# EAGLE design tmod-pi (EAGLE 7.7.0)
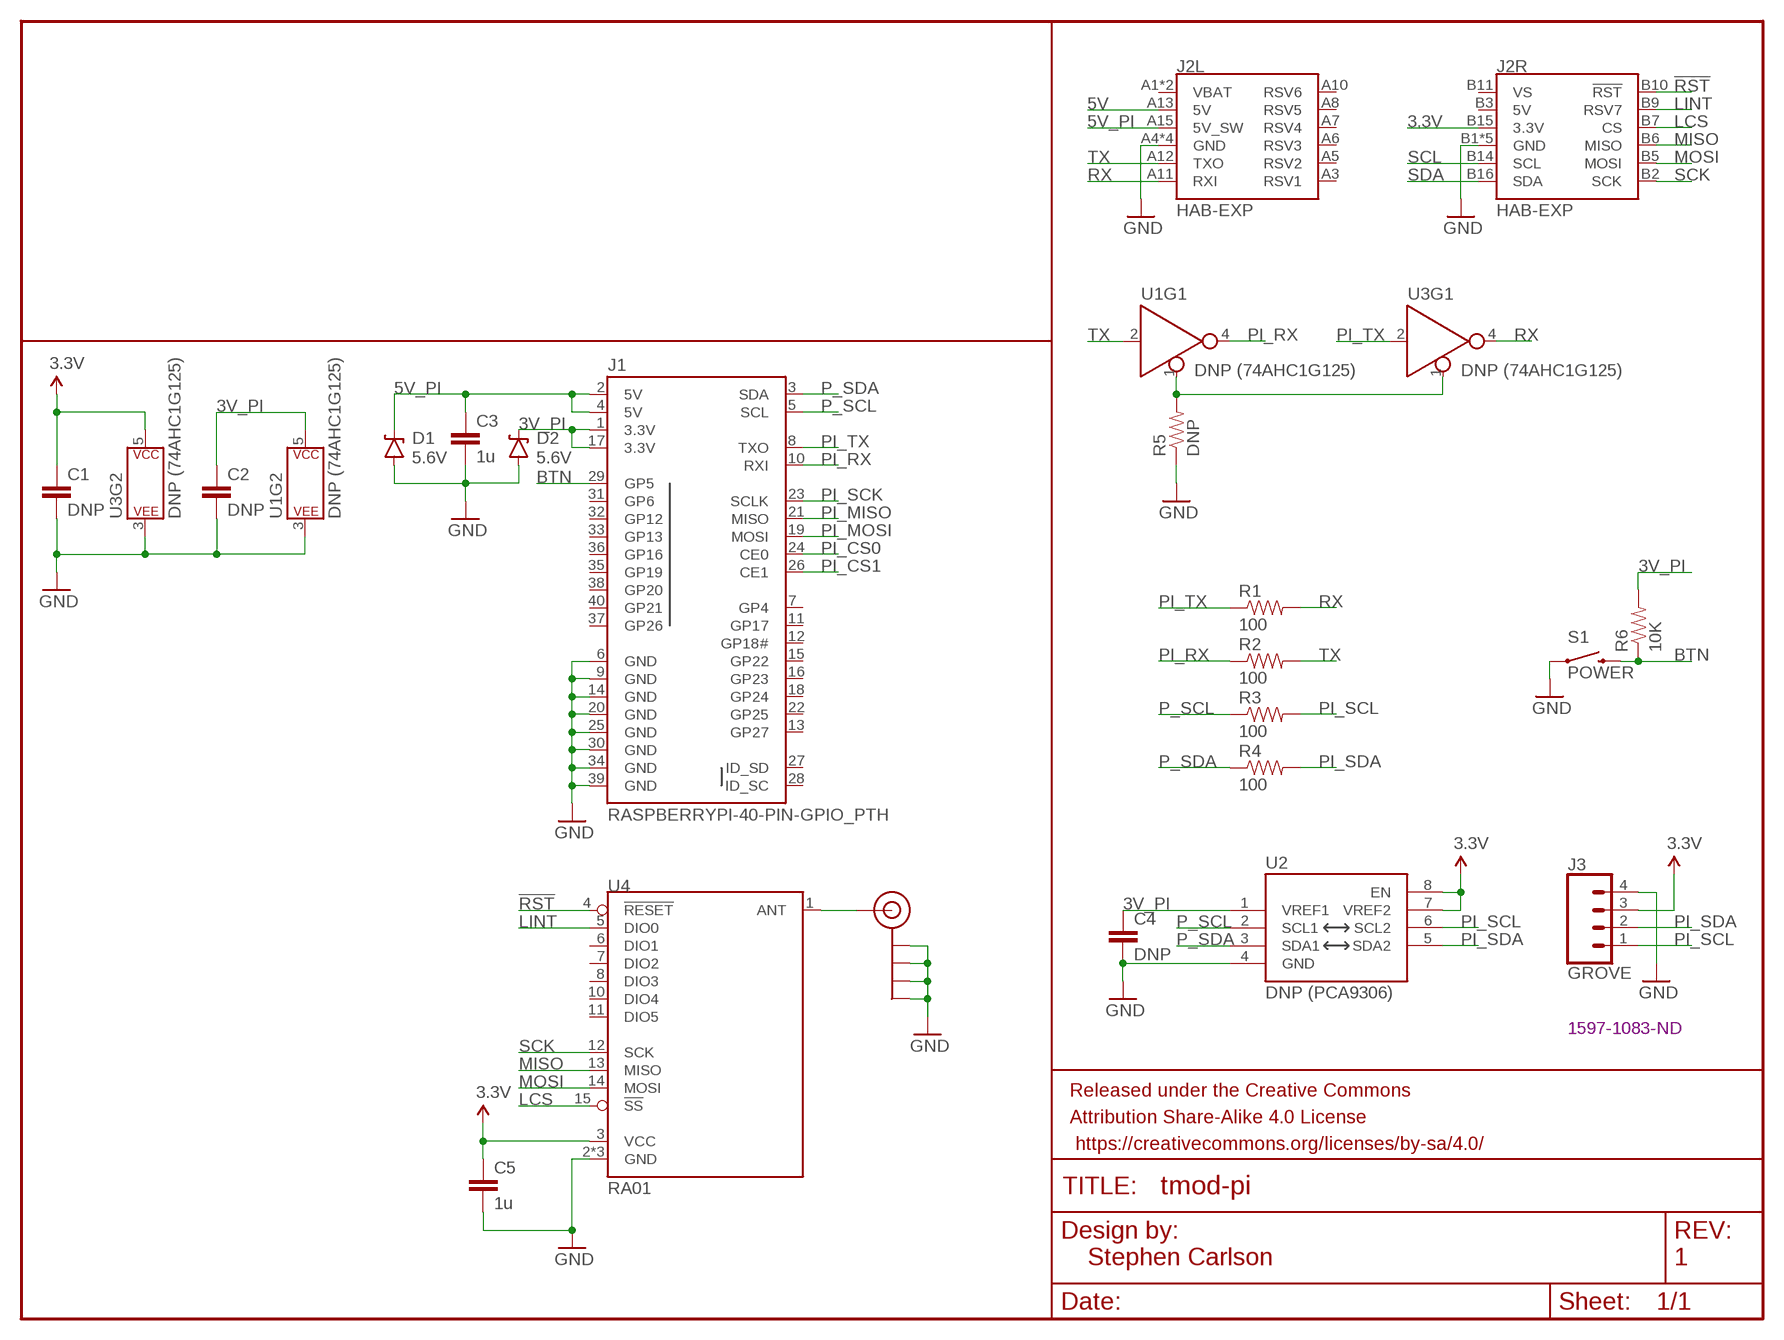
[diagram p0: schematic, sheet 1]

## Parts
C1  DNP  CAP0805  [0805]
C2  DNP  CAP0805  [0805]
C3  1u  CAP0805  [0805]
C4  DNP  CAP0805  [0805]
C5  1u  CAP0805  [0805]
D1  5.6V  DIODE-ZENER5.6V  [SOD-323]
D2  5.6V  DIODE-ZENER5.6V  [SOD-323]
FRAME1  FRAME-LETTERNO_PACKAGE  [DUMMY]
J1  RASPBERRYPI-40-PIN-GPIO_PTH  [2X20_SHROUDED]
J2  HAB-EXP  [HAB-EXP]
J3  GROVE  CONN_04JST-PTH  [JST-4-PTH]
J4  SMA_EDGE  [SMA-EDGE]
R1  100  RESISTOR0805-RES  [0805]
R2  100  RESISTOR0805-RES  [0805]
R3  100  RESISTOR0805-RES  [0805]
R4  100  RESISTOR0805-RES  [0805]
R5  DNP  RESISTOR0805-RES  [0805]
R6  10K  RESISTOR0805-RES  [0805]
S1  POWER  SWITCH  [TACTILE-PTH-THIN]
U1  DNP (74AHC1G125)  74AHC1G125D  [SOT23-5]
U2  DNP (PCA9306)  PCA9306PCA9306DC-1:1  [PCA9306DC]
U3  DNP (74AHC1G125)  74AHC1G125D  [SOT23-5]
U4  RA01  [RA01]

## Nets
3.3V: C1.1 C5.1 J2.B15(R:3.3V) J3.3 U2.7(VREF2) U2.8(EN) U3.5(P$V+) U4.3(VCC)
3V_PI: C2.1 C4.1 D2.C J1.1(3.3V) J1.17(3.3V) R6.2 U1.5(P$V+) U2.1(VREF1)
5V: J2.A13(L:5V)
5V_PI: C3.1 D1.C J1.2(5V) J1.4(5V) J2.A15(L:5V_SW)
!RST!: J2.B10(R:!RST!) U4.4(!RESET!)
ANT: J4.SIG(SIGNAL) U4.1(ANT)
BTN: J1.29(GP5) R6.1 S1.2
GND: C1.2 C2.2 C3.2 C4.2 C5.2 D1.A D2.A J1.6(GND) J1.9(GND) J1.14(GND) J1.20(GND) J1.25(GND) J1.30(GND) J1.34(GND) J1.39(GND) J2.A4(L:GND) J2.A9(L:GND) J2.A14(L:GND) J2.A16(L:GND) J2.B1(R:GND) J2.B4(R:GND) J2.B8(R:GND) J2.B12(R:GND) J2.B13(R:GND) J3.4 J4.GND@0(GND) J4.GND@1(GND) J4.GND@2(GND) J4.GND@3(GND) R5.1 S1.1 U1.3(P$V-) U2.4(GND) U3.3(P$V-) U4.2(GND) U4.9(GND) U4.16(GND)
LCS: J2.B7(R:CS) U4.15(!SS!)
LINT: J2.B9(R:RSV7) U4.5(DIO0)
MISO: J2.B6(R:MISO) U4.13(MISO)
MOSI: J2.B5(R:MOSI) U4.14(MOSI)
P_SCL: J1.5(SCL) R3.1 U2.2(SCL1)
P_SDA: J1.3(SDA) R4.1 U2.3(SDA1)
PI_CS0: J1.24(CE0)
PI_CS1: J1.26(CE1)
PI_MISO: J1.21(MISO)
PI_MOSI: J1.19(MOSI)
PI_RX: J1.10(RXI) R2.1 U1.4(Y)
PI_SCK: J1.23(SCLK)
PI_SCL: J3.1 R3.2 U2.6(SCL2)
PI_SDA: J3.2 R4.2 U2.5(SDA2)
PI_TX: J1.8(TXO) R1.1 U3.2(A)
RX: J2.A11(L:RXI) R1.2 U3.4(Y)
SCK: J2.B2(R:SCK) U4.12(SCK)
SCL: J2.B14(R:SCL)
SDA: J2.B16(R:SDA)
TX: J2.A12(L:TXO) R2.2 U1.2(A)
UART_EN: R5.2 U1.1(!EN) U3.1(!EN)
Unconnected: J1.7(GP4) J1.11(GP17) J1.12(GP18#) J1.13(GP27) J1.15(GP22) J1.16(GP23) J1.18(GP24) J1.22(GP25) J1.27(ID_SD) J1.28(ID_SC) J1.31(GP6) J1.32(GP12) J1.33(GP13) J1.35(GP19) J1.36(GP16) J1.37(GP26) J1.38(GP20) J1.40(GP21) J2.A3(L:RSV1) J2.A5(L:RSV2) J2.A6(L:RSV3) J2.A7(L:RSV4) J2.A8(L:RSV5) J2.A10(L:RSV6) U4.6(DIO1) U4.7(DIO2) U4.8(DIO3) U4.10(DIO4) U4.11(DIO5)

## Notes on the sheet
- 1597-1083-ND
- Stephen Carlson | 1

## Power pins joined to a net without a drawn wire
5V: J2.B3(R:5V)
VBAT: J2.A1(L:VBAT) J2.A2(L:VBAT)
VS: J2.B11(R:VS)

## Library data of the parts
C1-C5 = SparkFun-Passives:CAP: Capacitor Standard 0603 ceramic capacitor, and 0.1" leaded capacitor.
D1 D2 = SparkFun-DiscreteSemi:DIODE-ZENER: Zener Diode Production Part - 8199 3.4V Zener Voltage; PROD_ID: DIO-12442
FRAME1 = SparkFun-Aesthetics:FRAME-LETTER: Schematic Frame - Letter Standard 8.5x11 US Letter frame; DESIGNER: Nobody; VERSION: v01
J1 = SparkFun-Connectors:RASPBERRYPI-40-PIN-GPIO: Raspberry Pi GPIO Header 2x20 pin connector, as found on B, B+, A+ models. Both shrouded PTH and SMT versions available. SparkFun Products: GPIO Shrouded Header <https://www.sparkfun.com/products/13054>- PTH SparkFun Pi Wedge (Preassembled) <https://www.sparkfun.com/products/13717>; PROD_ID: CONN-12263; SF_ID: PRT-13054
J2 = HAB:HAB-EXP: HAB Expansion Connector Dual 2x8 expansion connectors for HAB project
J3 = SparkFun-Connectors:CONN_04: Multi connection point. Often used as Generic Header-pin footprint for 0.1 inch spaced/style header connections On any of the 0.1 inch spaced packages, you can populate with these: Break Away Headers - Straight <https://www.sparkfun.com/products/116> (PRT-00116) Break Away Male Headers - Right Angle <https://www.sparkfun.com/products/553> (PRT-00553) Female Headers <https://www.sparkfun.com/products/115> (PRT-00115) Break Away Headers - Machine Pin <https://www.sparkfun.com/products/117> (PRT-00117) Break Away Female Headers - Swiss Machine Pin <https://www.sparkfun.com/products/743> (PRT-00743) For SCREWTERMINALS and SPRING TERMINALS visit here: Screw Terimnals on SparkFun.com <https://www.sparkfun.com/search/results?term=Screw+Terminals> (5mm/3.5mm/2.54mm spacing) This device is also useful as a general connection point to wire up your design to another part of your project. Our various solder wires solder well into these plated through hole pads. Hook-Up Wire - Assortment (Stranded, 22 AWG) <https://www.sparkfun.com/products/11375> (PRT-11375) Hook-Up Wire - Assortment (Solid Core, 22 AWG) <https://www.sparkfun.com/products/11367> (PRT-11367) View the entire wire category on our website here <https://www.sparkfun.com/categories/141> Special notes: Molex polarized connector foot print use with SKU : PRT-08231 with associated crimp pins and housings. 1MM SMD Version SKU: PRT-10208; PROD_ID: WIRE-13531; SF_ID: PRT-09916
J4 = SparkFun-Retired:SMA_EDGE: SMA Antenna Connector End launch SMA connector. The paste layer has been removed so that the connector can be hand soldered onto the board after reflow.
R1-R6 = SparkFun-Passives:RESISTOR: Resistor Basic schematic elements and footprints for 0603, 1206, and PTH resistors.
S1 = HAB:SWITCH: SWITCH Package for the MJTP1250, a thinner and lighter PTH push button switch.
U1 U3 = SparkFun-IC-Logic:74*1G125: Single buffer Buffers & Line Drivers Tri-State Single Bus SOT-23-5 Datasheet SparkFun Products SparkFun SAMD21 Mini Breakout <https://www.sparkfun.com/products/13664> (DEV-13664) SparkFun SAMD21 Dev Breakout <https://www.sparkfun.com/products/13672> (DEV-13672) SparkFun MIDI Shield <https://www.sparkfun.com/products/12898> (DEV-12898) SparkFun WiFi Shield - CC3000 <https://www.sparkfun.com/products/12071> (DEV-12071); PROD_ID: IC-11920; VALUE: SN74AHC1G125
U2 = SparkFun-IC-Comms:PCA9306: Bidirectional I2C level shifter Not compatible with all available part number pinout schemes- DOUBLE CHECK!!! Datasheet <https://cdn.sparkfun.com/datasheets/BreakoutBoards/PCA9306DC.pdf> SparkFun Products SparkFun Inventor's Kit for RedBot <https://www.sparkfun.com/products/12649> (ROB-12649) SparkFun RedBot Basic Kit <https://www.sparkfun.com/products/13166> (ROB-13166) SparkFun Level Translator Breakout - PCA9306 <https://www.sparkfun.com/products/11955> (BOB-11955) SparkFun Block for Intel Edison - ADC <https://www.sparkfun.com/products/13770> (DEV-13770) SparkFun Block for Intel® Edison - Raspberry Pi B <https://www.sparkfun.com/products/13044> (DEV-13044) SparkFun RedBot Sensor - Accelerometer <https://www.sparkfun.com/products/12589> (SEN-12589); PROD_ID: IC-10023; VALUE: PCA9306
U4 = HAB:RA01: RA-01 LoRA RA-01 LoRA module with external antenna

## Board
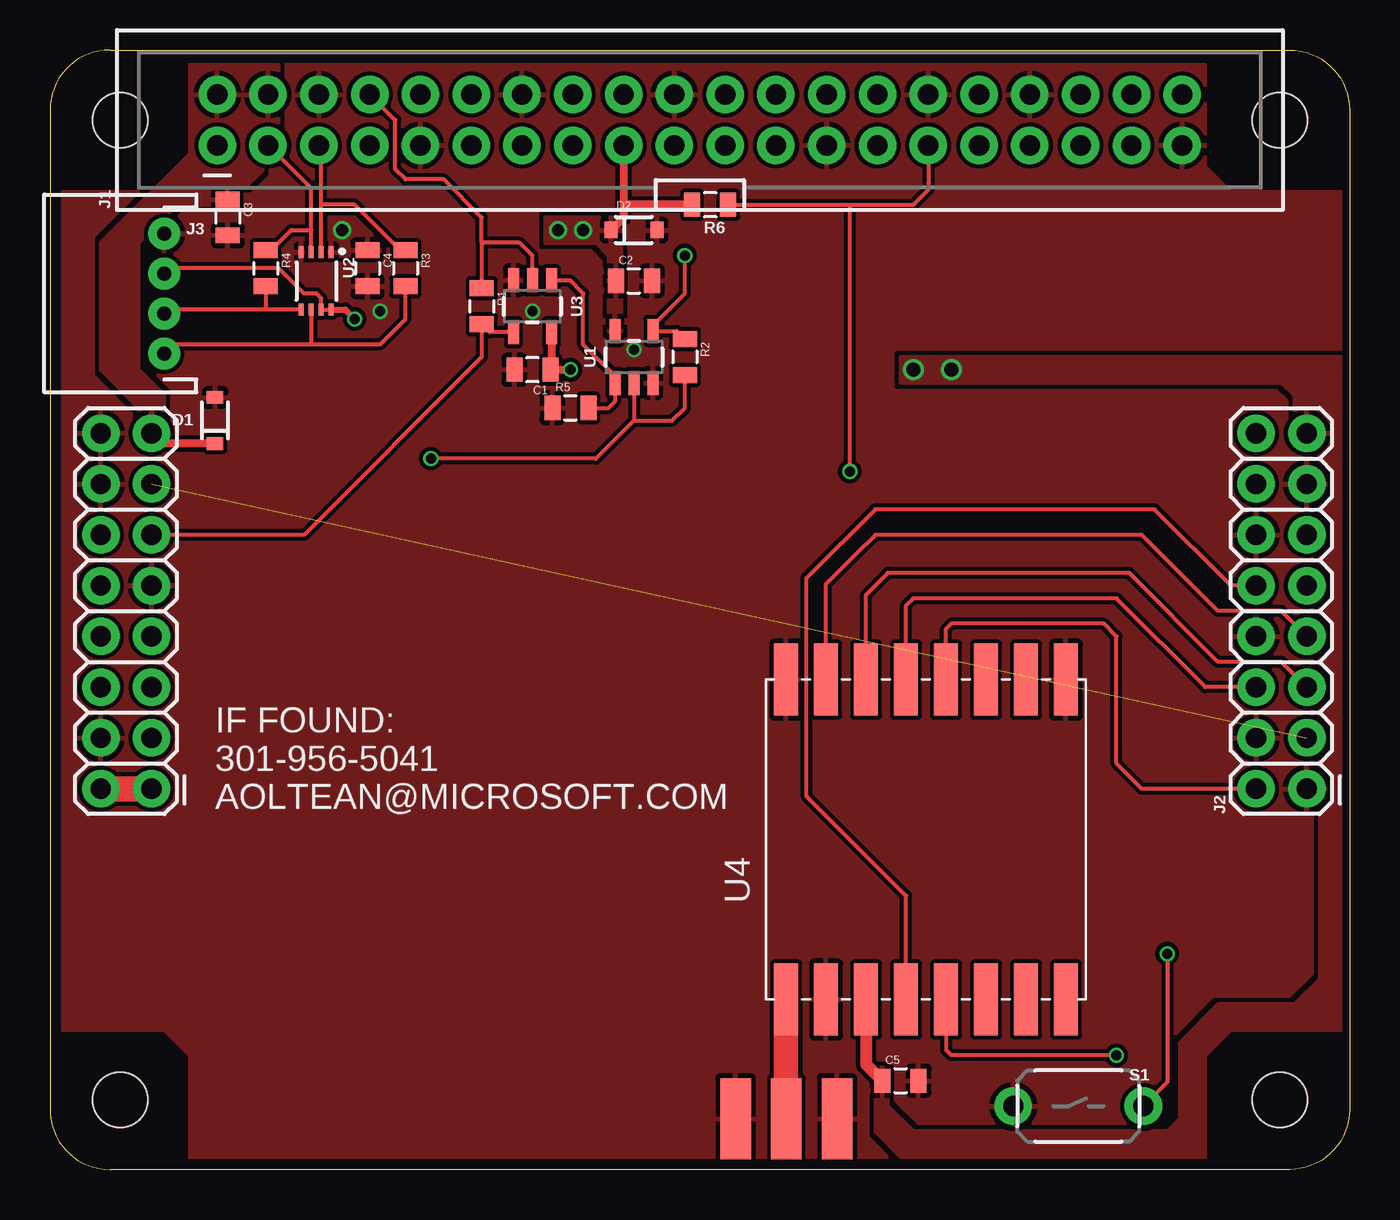
[diagram p1: board, top side]
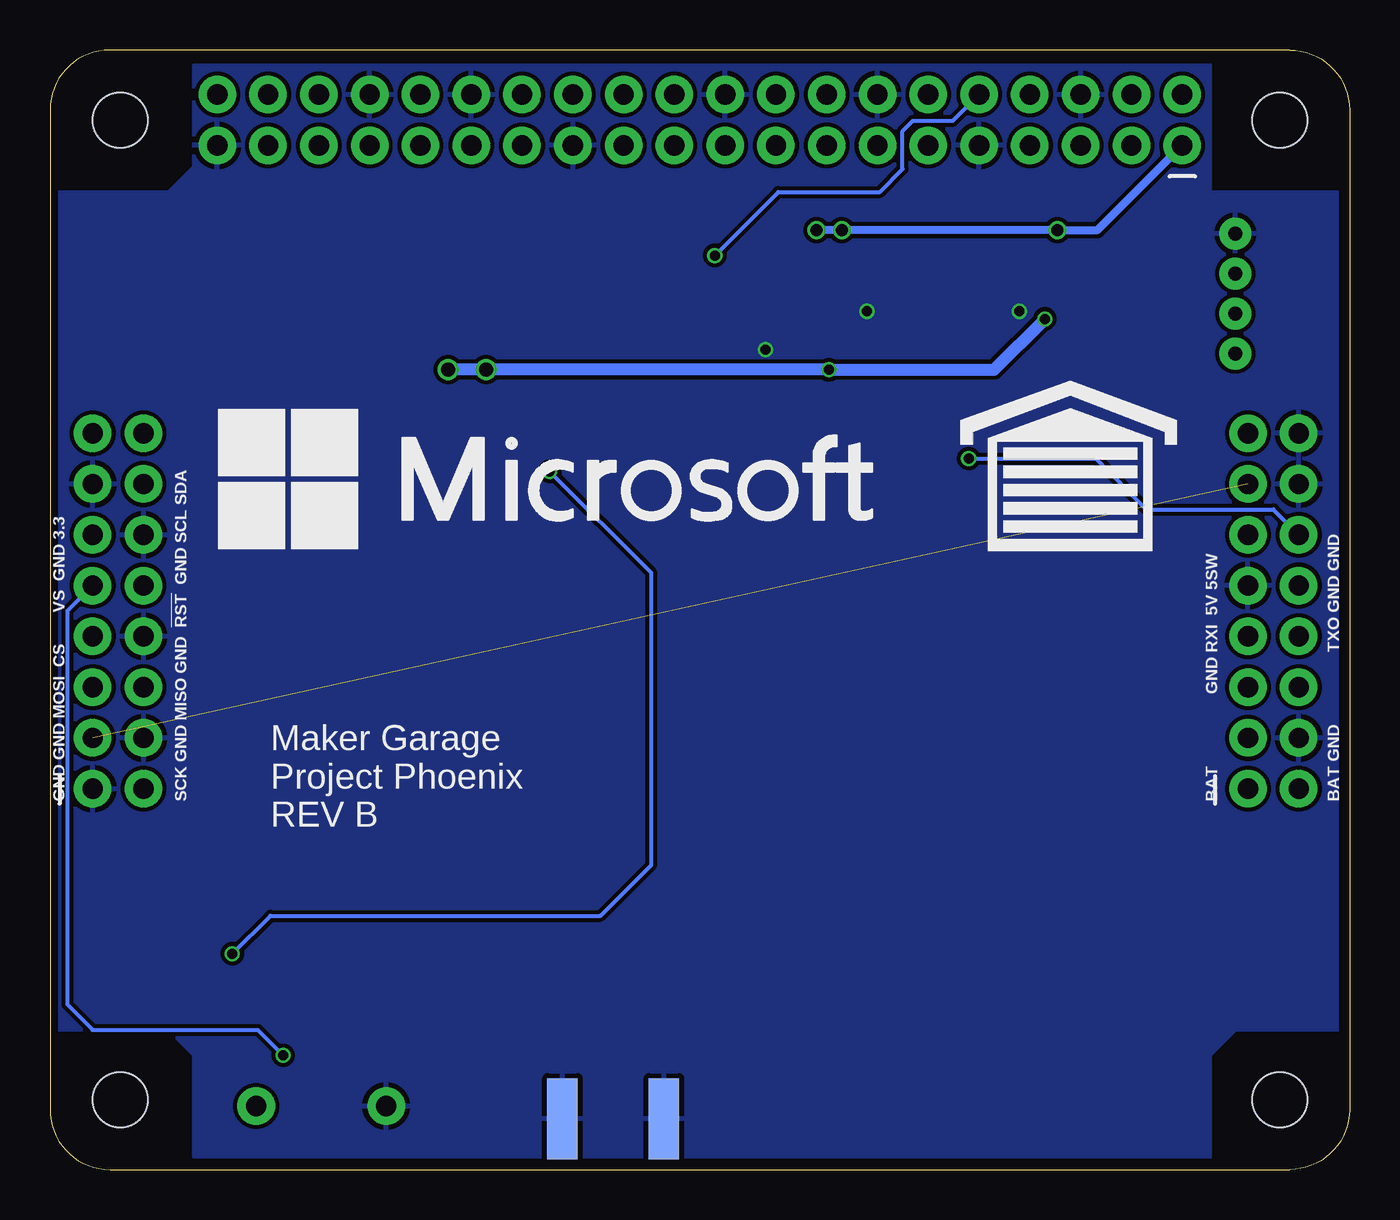
[diagram p2: board, bottom side, seen from below]

Size 65 x 56 mm. Coordinates in mm from the lower left corner, seen from the top.
Outline: 0,53 0,3 arc90 3,0 62,0 arc90 65,3 65,53 arc90 62,56 3,56 arc90 0,53
Copper layers (1*16): Top 0.035559375mm / dielectric 1.6mm / Bottom 0.035559375mm
Design rules "oshpark-2layer *": minimum track width 6mil, minimum drill 10mil, track to track 6mil, track to pad 6mil, pad to pad 6mil, via to via 6mil, smd to smd 6mil, copper to edge 15mil, drill to drill 6mil, minimum pad ring 5mil, minimum via ring 5mil, stop-mask expansion 2.5mil, vias tented up to drill 0mil, thermal gap 10mil
Holes 2.75 mm at 3.5,52.5 61.5,3.5 3.5,3.5 61.5,52.5
tKeepout: area 0.5,49.5 to 6.5,55.5; area 0.5,0.5 to 6.5,6.5; area 58.5,0.5 to 64.5,6.5; area 58.5,49.5 to 64.5,55.5

### Footprints (pad centres in the part's own frame; a part is rotated, then mirrored left to right if it is on the bottom)
0805 = smd 0.8 x 1.2: 1 -0.9,0; 2 0.9,0
SOD-323 = smd 0.63 x 0.83: A 1.15,0; C -1.15,0
2X20_SHROUDED = drill 1.016 pad 1.88: 1 -1.27,24.13; 2 1.27,24.13; 3 -1.27,21.59; 4 1.27,21.59; 5 -1.27,19.05; 6 1.27,19.05; 7 -1.27,16.51; 8 1.27,16.51; 9 -1.27,13.97; 10 1.27,13.97; 11 -1.27,11.43; 12 1.27,11.43; 13 -1.27,8.89; 14 1.27,8.89; 15 -1.27,6.35; 16 1.27,6.35; 17 -1.27,3.81; 18 1.27,3.81; 19 -1.27,1.27; 20 1.27,1.27; 21 -1.27,-1.27; 22 1.27,-1.27; 23 -1.27,-3.81; 24 1.27,-3.81; 25 -1.27,-6.35; 26 1.27,-6.35; 27 -1.27,-8.89; 28 1.27,-8.89; 29 -1.27,-11.43; 30 1.27,-11.43; 31 -1.27,-13.97; 32 1.27,-13.97; 33 -1.27,-16.51; 34 1.27,-16.51; 35 -1.27,-19.05; 36 1.27,-19.05; 37 -1.27,-21.59; 38 1.27,-21.59; 39 -1.27,-24.13; 40 1.27,-24.13
HAB-EXP = drill 1.016 pad 1.88: A1 17.78,2.54; A2 17.78,0; A3 15.24,2.54; A4 15.24,0; A5 12.7,2.54; A6 12.7,0; A7 10.16,2.54; A8 10.16,0; A9 7.62,2.54; A10 7.62,0; A11 5.08,2.54; A12 5.08,0; A13 2.54,2.54; A14 2.54,0; A15 0,2.54; A16 0,0; B1 17.78,60.325; B2 17.78,57.785; B3 15.24,60.325; B4 15.24,57.785; B5 12.7,60.325; B6 12.7,57.785; B7 10.16,60.325; B8 10.16,57.785; B9 7.62,60.325; B10 7.62,57.785; B11 5.08,60.325; B12 5.08,57.785; B13 2.54,60.325; B14 2.54,57.785; B15 0,60.325; B16 0,57.785
JST-4-PTH = drill 0.7 pad 1.6: 1 -3,0; 2 -1,0; 3 1,0; 4 3,0
SMA-EDGE = smd 1.524 x 4.064: GND@0 0,0; GND@1 5.08,0; SIG 2.54,0 | smd 1.524 x 4.064 bottom: GND@2 0,0; GND@3 5.08,0
TACTILE-PTH-THIN = drill 1.016 pad 1.88: 1 -3.251,0; 2 3.251,0
SOT23-5 = smd 0.55 x 1.2: 1 -0.95,-1.3; 2 0,-1.3; 3 0.95,-1.3; 4 0.95,1.3; 5 -0.95,1.3
PCA9306DC = smd 0.25 x 0.602: 1 -0.73,-1.446; 2 -0.23,-1.446; 3 0.27,-1.446; 4 0.77,-1.446; 5 0.77,1.431; 6 0.27,1.431; 7 -0.23,1.431; 8 -0.73,1.431
RA01 = smd 3.6 x 1.2: 1 -8,7; 2 -8,5; 3 -8,3; 4 -8,1; 5 -8,-1; 6 -8,-3; 7 -8,-5; 8 -8,-7; 9 8,-7; 10 8,-5; 11 8,-3; 12 8,-1; 13 8,1; 14 8,3; 15 8,5; 16 8,7

### Placement (x,y rotation side)
C1  24.13,40.01 180 top
C2  29.21,44.45 0 top
C3  8.89,47.62 270 top
C4  15.88,45.09 270 top
C5  42.55,4.45 0 top
D1  8.26,37.47 90 top
D2  29.21,46.99 0 top
FRAME1  0,57.15 0 top
J1  32.5,52.5 90 top
J2  2.54,36.83 270 top
J3  5.71,43.81 90 top
J4  34.29,2.54 0 top
R1  21.59,43.18 270 top
R2  31.75,40.64 270 top
R3  17.78,45.09 270 top
R4  10.79,45.09 270 top
R5  26.04,38.1 0 top
R6  33.02,48.26 180 top
S1  51.44,3.17 0 top
U1  29.21,40.64 0 top
U2  13.34,44.45 180 top
U3  24.13,43.18 180 top
U4  43.81,16.51 90 top
U$1  [MSFT_LOGO]  37.47,34.29 0 bottom
U$2  [GARAGE]  13.97,34.29 0 bottom

### Tracks (layer width: path | path; a pad name or v marks a point on that pad's centre or on a via)
3.3V  (via drill 0.5, 0.7)
  Top 0.203: J3.3 5.99,45.09 11.43,45.09 12.7,43.81 13.34,43.81 13.56,43.59 U2.7 U2.8
  Top 0.305: U2.8 14.77,43.02 v15.24,42.55
  Top 0.406: U3.5 25.08,40.05 C1.1 v26.04,40.01
  Top 0.61: U4.3 40.81,5.28 C5.1
  Bottom 0.61: v15.24,42.55 17.78,40.01 v26.04,40.01 v45.09,40.01
  other vias: 43.18,40.01
  pour Top (isolate 0.305, rank 2): 42.55,40.64 42.55,39.37 61.59,39.37 62.23,38.73 62.23,36.2 62.87,36.2 63.5,35.56 63.5,9.53 62.23,8.26 58.42,8.26 56.52,6.35 56.52,2.54 55.88,1.91 43.18,1.91 41.91,3.17 41.91,5.08 41.27,5.08 41.27,1.91 42.55,0.64 57.78,0.64 57.78,5.71 59.05,6.99 64.77,6.99 64.77,40.64
3V_PI  (via drill 0.6)
  Top 0.406: J1.17 28.69,48.26 | 28.69,48.26 28.69,47.62 D2.C | R6.2 28.69,48.26
  Bottom 0.406: v26.67,46.99 v14.61,46.99 12.61,46.99 J1.1
  other vias: 25.4,46.99
  pour Top (isolate 0.203, rank 2): 24.77,47.62 24.77,46.35 27.3,46.35 27.94,45.72 27.94,41.91 28.57,41.91 28.57,47.62
  pour Top (isolate 0.203, rank 2): 13.97,47.62 13.97,45.72 16.51,45.72 16.51,46.35 15.24,47.62
5V  (1 unrouted)
5V_PI
  Top 0.406: D1.C 5.59,36.31 J2.A15
  pour Top (isolate 0.203, rank 2): 6.99,55.24 6.99,50.8 2.54,46.35 2.54,40.01 4.45,38.1 4.45,36.2 5.71,36.2 5.71,38.73 4.45,40.01 4.45,46.35 6.35,48.26 8.89,48.26 11.43,50.8 11.43,55.24
!RST!
  Top 0.203: J2.B10 59.05,29.21 55.24,33.02 41.27,33.02 37.85,29.59 37.85,18.67 42.81,13.7 U4.4
ANT
  Top 1.232: U4.1 36.81,2.56 J4.SIG
BTN  (via drill 0.5)
  Top 0.203: R6.1 40.01,48.26 | 40.01,48.26 43.18,48.26 43.93,49.01 J1.29 | v40.01,34.92 40.01,48.26 | v55.88,10.79 55.88,4.37 S1.2
  Bottom 0.203: v55.88,10.79 53.98,12.7 37.47,12.7 34.92,15.24 34.92,29.84 v40.01,34.92
GND  (via drill 0.5)
  other vias: 16.51,42.93 24.13,42.93 29.21,41.02
  pour Top (isolate 0.203, rank 4): 0.64,48.9 0.64,6.99 5.71,6.99 6.99,5.71 6.99,0.64 57.78,0.64 57.78,5.71 59.05,6.99 64.77,6.99 64.77,48.9 59.05,48.9 57.78,50.16 57.78,55.24 6.99,55.24 6.99,48.9
  pour Bottom (isolate 0.203, rank 4): 0.64,48.9 0.64,6.99 5.71,6.99 6.99,5.71 6.99,0.64 57.78,0.64 57.78,5.71 59.05,6.99 64.77,6.99 64.77,48.9 59.05,48.9 57.78,50.16 57.78,55.24 6.99,55.24 6.99,48.9
LCS
  Top 0.203: J2.B7 61.59,27.94 58.42,27.94 54.61,31.75 41.27,31.75 40.32,30.8 39.37,29.84 38.81,29.29 U4.15
LINT  (via drill 0.5)
  Top 0.203: v53.34,5.71 45.09,5.71 44.81,5.99 U4.5
  Bottom 0.203: J2.B9 64.14,27.94 64.14,8.26 62.87,6.99 54.61,6.99 v53.34,5.71
MISO
  Top 0.203: J2.B6 57.78,24.13 53.34,28.57 43.18,28.57 42.81,28.21 U4.13
MOSI
  Top 0.203: J2.B5 61.59,25.4 58.42,25.4 53.98,29.84 41.91,29.84 40.81,28.75 U4.14
P_SCL
  Top 0.203: U2.2 13.56,48.26 | 13.56,48.26 13.56,51.12 J1.5 | R3.1 17.52,45.98 15.24,48.26 13.56,48.26
P_SDA
  Top 0.203: U2.3 13.06,46.99 | 13.06,46.99 13.06,49.08 J1.3 | R4.1 11.06,45.98 12.06,46.99 13.06,46.99
PI_RX  (via drill 0.5)
  Top 0.203: R2.1 31.35,41.94 U1.4 30.16,42.23 31.75,43.81 v31.75,45.72
  Bottom 0.203: v31.75,45.72 28.57,48.9 23.5,48.9 22.35,50.04 22.35,51.94 21.84,52.45 19.85,52.45 J1.10
PI_SCL
  Top 0.203: J3.1 5.89,40.81 6.35,41.27 13.06,41.27 | R3.2 17.78,42.55 16.51,41.27 13.06,41.27 | U2.6 13.06,41.27
PI_SDA
  Top 0.203: U2.5 10.79,43.02 | 10.79,43.02 5.92,43.02 J3.2 | R4.2 10.79,43.02
PI_TX
  Top 0.203: U3.2 24.13,45.72 23.5,46.35 21.59,46.35 | 21.59,46.35 R1.1 | 21.59,46.35 21.59,47.62 19.68,49.53 17.78,49.53 17.27,50.04 17.27,52.49 J1.8
RX
  Top 0.203: U3.4 21.99,41.88 R1.2 21.59,40.64 12.7,31.75 J2.A11
SCK
  Top 0.203: J2.B2 54.61,19.05 53.34,20.32 53.34,26.67 52.7,27.3 45.09,27.3 44.81,27.04 U4.12
TX  (via drill 0.5)
  Top 0.203: U1.2 29.21,37.47 | 29.21,37.47 31.11,37.47 31.75,38.1 R2.2 | 29.21,37.47 27.3,35.56 v19.05,35.56
  Bottom 0.203: v19.05,35.56 12.7,35.56 10.16,33.02 3.81,33.02 J2.A12
UART_EN
  Top 0.203: R5.2 27.94,38.1 28.26,38.42 U1.1 28.26,39.69 26.67,41.27 26.67,43.81 26,44.48 U3.1
VBAT
  Top 1.27: J2.A2 J2.A1

### Text on the board
tPlace: IF FOUND: / 301-956-5041 / AOLTEAN@MICROSOFT.COM
bPlace: BAT GND TXO GND GND | BAT GND RXI 5V 5SW | SCK GND MISO GND !RST! GND SCL SDA | GND GND MOSI CS VS GND 3.3 | Maker Garage / Project Phoenix / REV B